# Altium schematic sheet RGB LED.SchDoc
size A; SheetNumber: 8; SheetTotal: 9
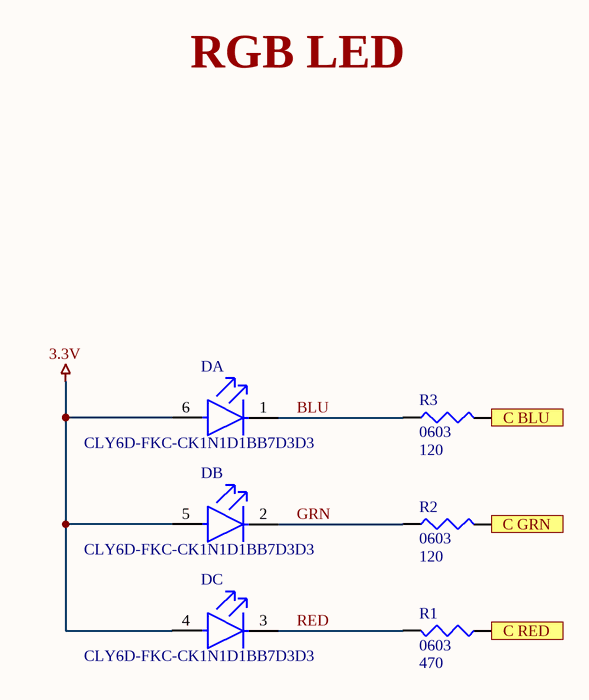
[diagram p0: RGB LED.SchDoc]

## Parts
D  CLY6D-FKC-CK1N1D1BB7D3D3  [FP-CLY6D-FKC-MFG]  (parts A,B,C of 3)
R1  0603  value 470  [J1-0603]
R2  0603  value 120  [J1-0603]
R3  0603  value 120  [J1-0603]

## Ports
C BLU (out), C GRN (out), C RED (out)

## Nets
3.3V: D.4(RED(A)) D.5(GREEN(A)) D.6(BLUE(A))
BLU: D.1(BLUE(C)) R3.1
C BLU: R3.2 ; port C BLU
C GRN: R2.2 ; port C GRN
C RED: R1.1 ; port C RED
GRN: D.2(GREEN(C)) R2.1
RED: D.3(RED(C)) R1.2

## Notes on the sheet
- RGB LED

## Library data of the parts
D = CMP-13977-000015-1: LED RGB DIFFUSED 6PLCC SMD; Forward Voltage: 3V; Luminous Intensity: 240mcd; Lens Color: White; Dominant Wavelength: 470nm; Test Current: 10mA; Color: Blue; Lens Transparency: Diffused; Width: 2.8mm; Height: 2.6mm; Mount: Surface Mount; Length: 2.8mm; Case/Package: SMD/SMT; Packaging: Tape and Reel
R1-R3 = Res3: Resistor; Published: 8-Jun-2000; LatestRevisionDate: 29-May-2009; LatestRevisionNote: IPC-7351 Footprint Added.; PackageReference: J1-0603; Publisher: Altium Limited; PackageDescription: Chip Resistor